# Altium project powerManager.PrjPcb
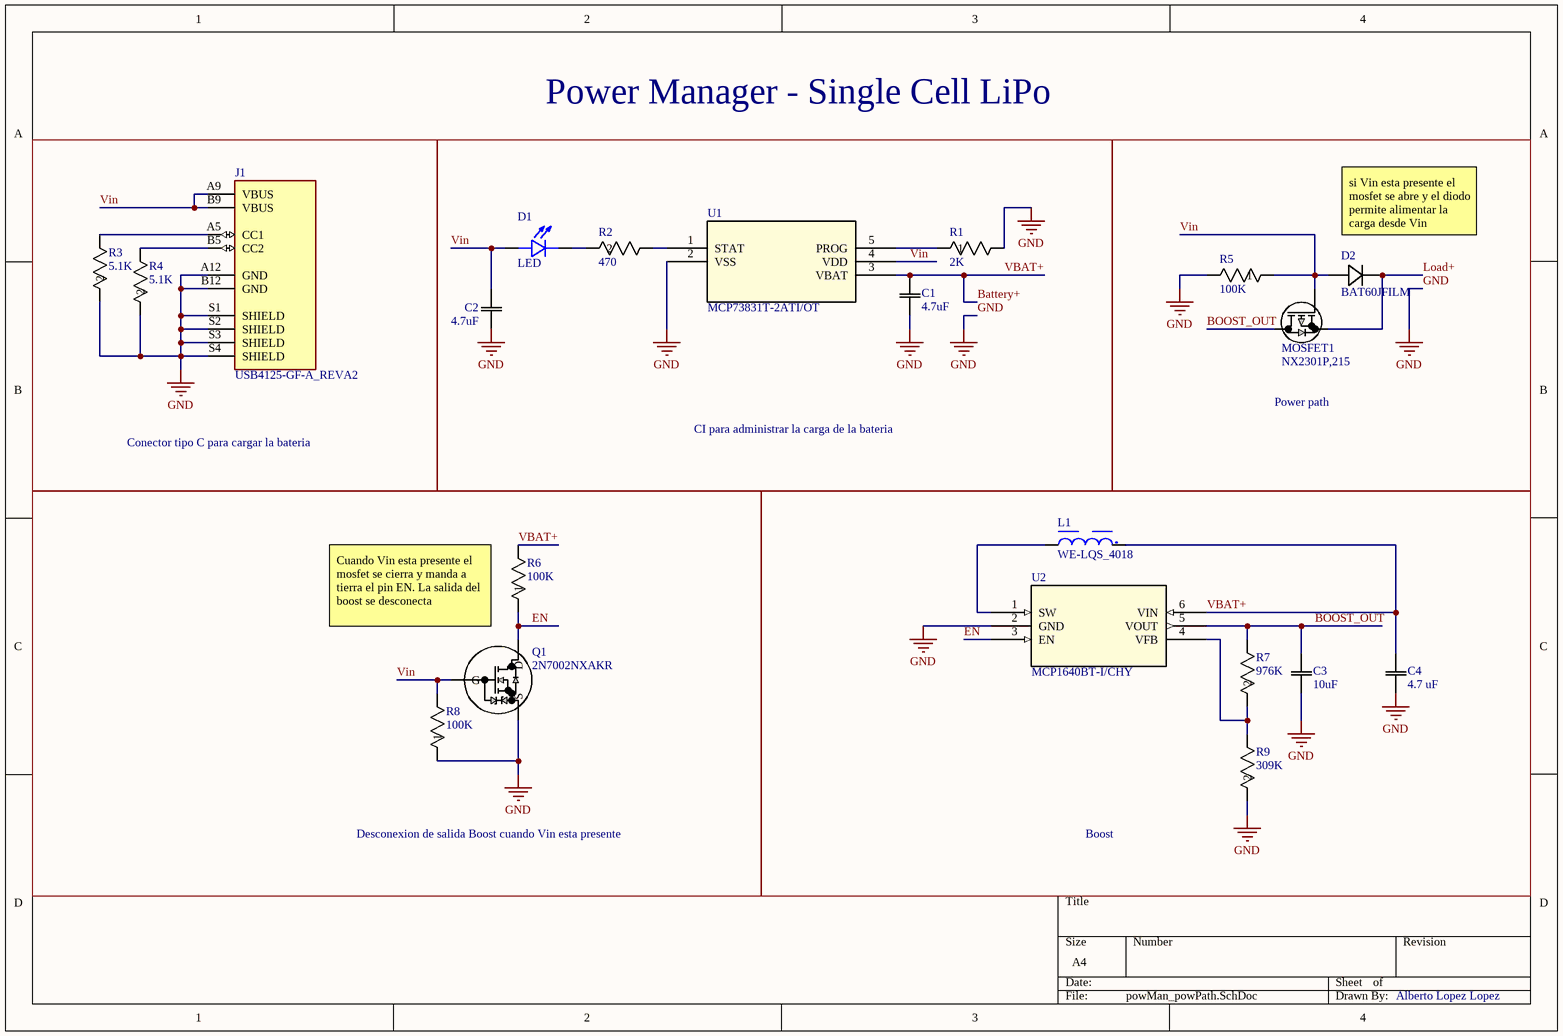
[diagram p0: powMan_powPath.SchDoc]
1 sheet, 21 parts. Net scope: global (net labels, ports and power ports of the same name join across sheets).
Board file: powMan_powPath.PcbDoc

## Sheet powMan_powPath.SchDoc
size A4; SheetNumber: 1; SheetTotal: 1

### Parts
C1  4.7uF  [CAP_0603_CL10A_1P6XP8_SAM]
C2  4.7uF  [CAP_0603_CL10A_1P6XP8_SAM]
C3  10uF  [CAP_0603_X1_WAL]
C4  4.7 uF  [CAP_0603_CL10A_1P6XP8_SAM]
D1  LED  [LED_KT-0805W]
D2  BAT60JFILM  [CR_60JFILM_STM]
J1  USB4125-GF-A_REVA2  [GCT_USB4125-GF-A_REVA2]
L1  WE-LQS_4018  [WE-LQS_4018]
MOSFET1  NX2301P,215  [SOT23_TO-236AB_NEX-L]
Q1  2N7002NXAKR  [TO-236AB_SOT23_NEX]
R1  2K  [RC0603N_YAG-L]
R2  470  [RC0603N_YAG-L]
R3  5.1K  [RC0603N_YAG-L]
R4  5.1K  [RC0603N_YAG-L]
R5  100K  [RC0603N_YAG-L]
R6  100K  [RC0603N_YAG-L - duplicate]
R7  976K  [RC0603N_YAG]
R8  100K  [RC0603N_YAG-L - duplicate]
R9  309K  [RC0603N_YAG]
U1  MCP73831T-2ATI/OT  [SOT-23-5_MC_MCH]
U2  MCP1640BT-I/CHY  [SOT-23-6_MC_MCH]

### Blocks framed on the sheet
Conector tipo C para cargar la bateria: J1 R3 R4
CI para administrar la carga de la bateria: C1 C2 D1 R1 R2 U1
Power path: D2 MOSFET1 R5
Desconexion de salida Boost cuando Vin esta presente: Q1 R6 R8
Boost: C3 C4 L1 R7 R9 U2

### Nets
GND: C1.1 C2.1 C3.1 C4.1 J1.A12(GND) J1.B12(GND) J1.S1(SHIELD) J1.S2(SHIELD) J1.S3(SHIELD) J1.S4(SHIELD) Q1.2(S) R1.2 R3.2 R4.2 R5.2 R8.1 R9.2 U1.2(VSS) U2.2(GND)
Battery+: C1.2 C4.2 L1.2 R6.2 U1.3(VBAT) U2.6(VIN)  [also labelled VBAT+]
BOOST_OUT: C3.2 MOSFET1.1 R7.1 U2.5(VOUT)
EN: Q1.3(D) R6.1 U2.3(EN)
Load+: D2.1 MOSFET1.2
Vin: C2.2 D1.A D2.2 J1.A9(VBUS) J1.B9(VBUS) MOSFET1.3 Q1.1(G) R5.1 R8.2 U1.4(VDD)
NetD1_C: D1.C R2.2
NetJ1_A5: J1.A5(CC1) R3.1
NetJ1_B5: J1.B5(CC2) R4.1
NetL1_1: L1.1 U2.1(SW)
NetR1_1: R1.1 U1.5(PROG)
NetR2_1: R2.1 U1.1(STAT)
NetR7_2: R7.2 R9.1 U2.4(VFB)

### Notes on the sheet
- Power Manager - Single Cell LiPo
- (near D2) si Vin esta presente el mosfet se abre y el diodo permite alimentar la carga desde Vin
- Cuando Vin esta presente el mosfet se cierra y manda a tierra el pin EN. La salida del boost se desconecta
- Alberto Lopez Lopez

### Library data of the parts
C1 C2 C4 = CL10A475KP8NNNC: 4.7 uF Capacitor 0603; Manufacturer_Name: Samsung; Copyright: Copyright (C) 2025 Ultra Librarian. All rights reserved.; Manufacturer_Part_Number: CL10A475KP8NNNC
C3 = 0603X106M100CT: capacitor 10 uF 0603; Manufacturer_Name: Walsin; Copyright: Copyright (C) 2026 Ultra Librarian. All rights reserved.; Manufacturer_Part_Number: 0603X106M100CT
D1 = KT-0805W: Light Emitting Diodes; MF: Hubei KENTO Elec; SnapEDA_Link: https://www.snapeda.com/parts/KT-0805W/Hubei+KENTO+Elec/view-part/?ref=snap; Package: Package; Value: *; MP: KT-0805W; Check_prices: https://www.snapeda.com/parts/KT-0805W/Hubei+KENTO+Elec/view-part/?ref=eda
D2 = BAT60JFILM: 10 V General pupose  Signal Schottky Diode; Manufacturer_Name: STMicroelectronics; Copyright: Copyright (C) 2025 Ultra Librarian. All rights reserved.; Manufacturer_Part_Number: BAT60JFILM
J1 = USB4125-GF-A_REVA2: USB C female connector; Package: None; Availability: Unavailable; MP: USB4125-GF-A_REVA2; Value: *; Price: None
L1 = WE-LQS_4018: INDICATEUR FIXE 4,7 UH 1,7 A 70 MOHM CMS; MF: WÃ¼rth Elektronik; MP: 74404042047; SnapEDA_Link: https://www.snapeda.com/parts/74404042047/W%25C3%25BCrth+Elektronik+Midcom/view-part/?ref=snap; Package: Nonstandard WÃ¼rth Elektronik; Value: *; Check_prices: https://www.snapeda.com/parts/74404042047/W%25C3%25BCrth+Elektronik+Midcom/view-part/?ref=eda
MOSFET1 = NX2301P,215: MOSFET P-Chanel 400mW; Manufacturer_Name: Nexperia; Copyright: Copyright (C) 2025 Ultra Librarian. All rights reserved.; Manufacturer_Part_Number: NX2301P,215
Q1 = 2N7002NXAKR: N-MOSFET 60VDS 190ID; Manufacturer_Name: Nexperia; Copyright: Copyright (C) 2025 Ultra Librarian. All rights reserved.; Manufacturer_Part_Number: 2N7002NXAKR
R1 = RC0603FR-072KL: RES SMD 2kO 1% 1/10W 0603; Manufacturer_Name: Yageo; Copyright: Copyright (C) 2025 Ultra Librarian. All rights reserved.; Manufacturer_Part_Number: RC0603FR-072KL
R2 = RC0603FR-07470RL: RESISTOR; 0603; 470 OHM; 1%; 100PPM; 0.1W; THICK FILM; Manufacturer_Name: Yageo; Copyright: Copyright (C) 2026 Ultra Librarian. All rights reserved.; Manufacturer_Part_Number: RC0603FR-07470RL
R3 R4 = RC0603FR-075K1L: RES 5.1K SMD 0603; Manufacturer_Name: Yageo; Copyright: Copyright (C) 2025 Ultra Librarian. All rights reserved.; Manufacturer_Part_Number: RC0603FR-075K1L
R5 R6 R8 = RC0603FR-07100KL: RES, 100 k, 1%, 0.1 W, 0603; Manufacturer_Name: Yageo; Copyright: Copyright (C) 2025 Ultra Librarian. All rights reserved.; Manufacturer_Part_Number: RC0603FR-07100KL
R7 = RC0603FR-07976KL: resistor 976K 0603; Manufacturer_Name: Yageo; Copyright: Copyright (C) 2026 Ultra Librarian. All rights reserved.; Manufacturer_Part_Number: RC0603FR-07976KL
R9 = RC0603FR-07309KL: resistor 309K 0603; Manufacturer_Name: Yageo; Copyright: Copyright (C) 2025 Ultra Librarian. All rights reserved.; Manufacturer_Part_Number: RC0603FR-07309KL
U1 = MCP73831T-2ATIOT: Miniature Single-Cell, Fully Integrated Li-Ion, / Li-Polymer Charge Management Controller; Manufacturer_Name: Microchip; Copyright: Copyright (C) 2026 Ultra Librarian. All rights reserved.; Manufacturer_Part_Number: MCP73831T-2ATI/OT; RefDes: RefDes; Type: Type
U2 = MCP1640BT-ICHY: Boost Regulator max input 5.5V output 2 - 5.5V max output 350mA; Manufacturer_Name: Microchip; Copyright: Copyright (C) 2025 Ultra Librarian. All rights reserved.; Manufacturer_Part_Number: MCP1640BT-I/CHY; RefDes: RefDes; Type: Type